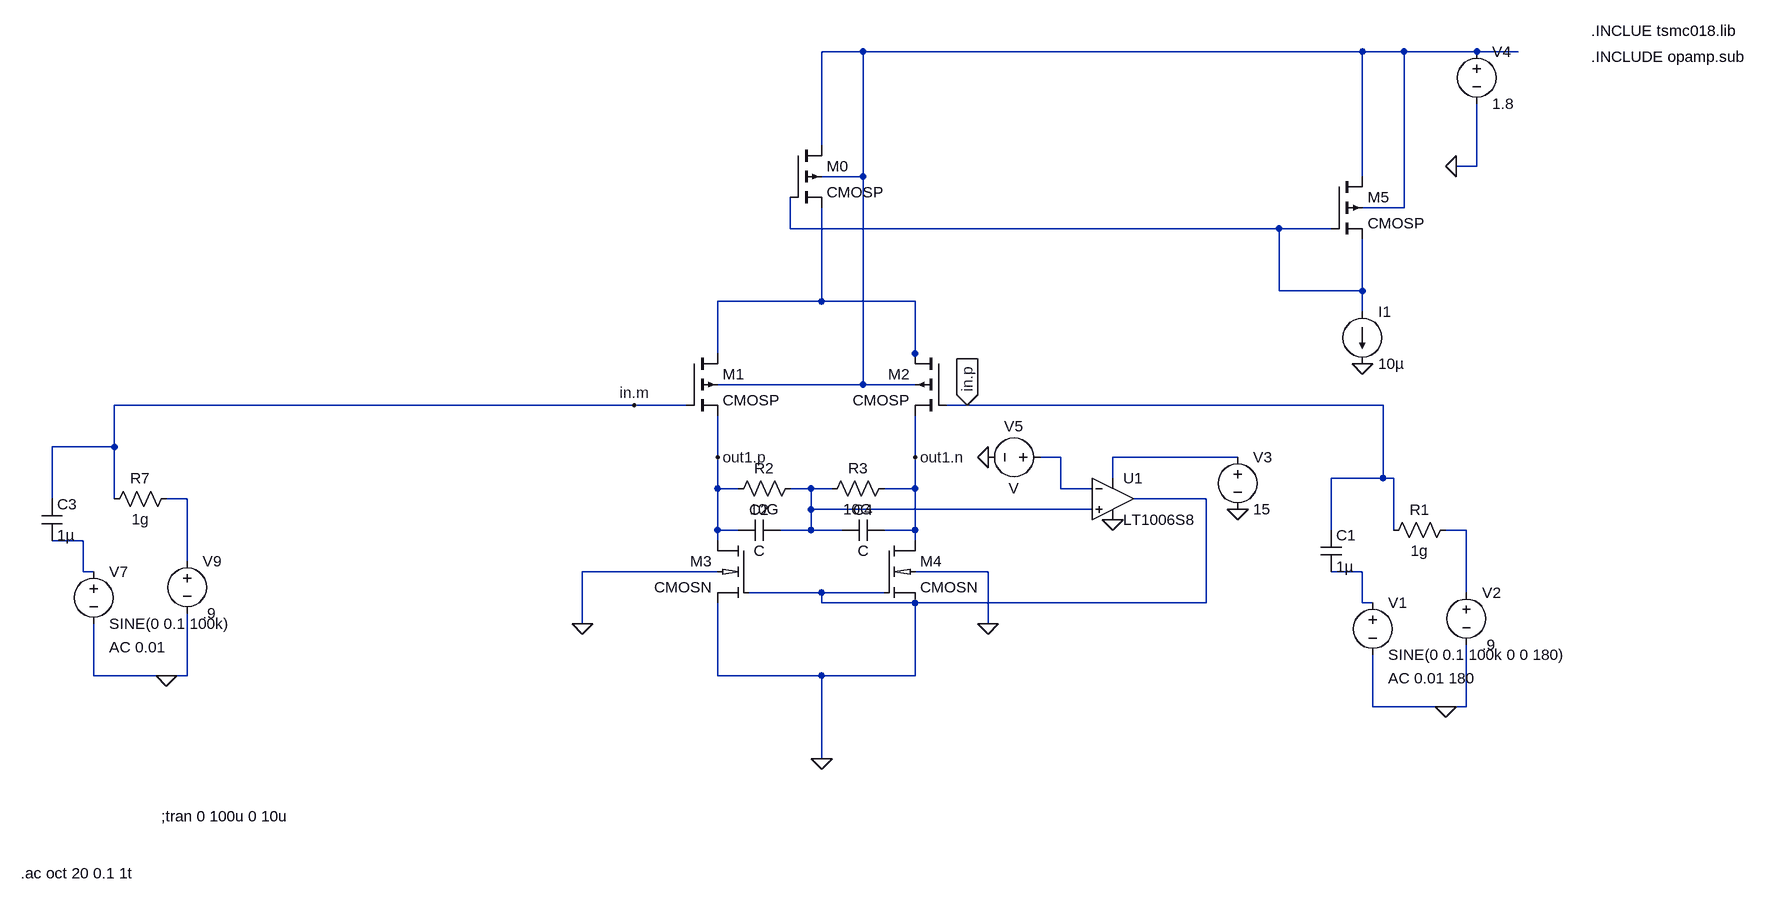
[diagram p0: schematic single_stage_diff.asc]
single_stage_diff.asc, the LTspice schematic file:
Version 4
SHEET 1 1436 736
WIRE 48 -544 -16 -544
WIRE 816 -544 48 -544
WIRE 880 -544 816 -544
WIRE 992 -544 880 -544
WIRE 1056 -544 992 -544
WIRE -16 -400 -16 -544
WIRE 992 -368 992 -464
WIRE 992 -368 960 -368
WIRE 48 -352 48 -544
WIRE 48 -352 -16 -352
WIRE 816 -352 816 -544
WIRE 880 -304 880 -544
WIRE 880 -304 816 -304
WIRE -64 -272 -64 -320
WIRE 688 -272 -64 -272
WIRE 768 -272 688 -272
WIRE 688 -176 688 -272
WIRE 816 -176 816 -256
WIRE 816 -176 688 -176
WIRE -16 -160 -16 -304
WIRE -16 -160 -176 -160
WIRE 128 -160 -16 -160
WIRE 816 -144 816 -176
WIRE -176 -80 -176 -160
WIRE 128 -80 128 -160
WIRE 128 -64 128 -80
WIRE 48 -32 48 -352
WIRE 48 -32 -176 -32
WIRE 128 -32 48 -32
WIRE -304 0 -1104 0
WIRE -224 0 -304 0
WIRE 208 0 176 0
WIRE 848 0 208 0
WIRE -1104 64 -1104 0
WIRE -1104 64 -1200 64
WIRE -176 80 -176 16
WIRE 128 80 128 16
WIRE 352 80 320 80
WIRE 624 80 432 80
WIRE 432 112 432 80
WIRE 848 112 848 0
WIRE 848 112 768 112
WIRE 864 112 848 112
WIRE -176 128 -176 80
WIRE -144 128 -176 128
WIRE -32 128 -64 128
WIRE 0 128 -32 128
WIRE 128 128 128 80
WIRE 128 128 80 128
WIRE 352 128 352 80
WIRE 400 128 352 128
WIRE -1200 144 -1200 64
WIRE -1104 144 -1104 64
WIRE -992 144 -1024 144
WIRE 576 144 464 144
WIRE -32 160 -32 128
WIRE 400 160 -32 160
WIRE -176 192 -176 128
WIRE -144 192 -176 192
WIRE -32 192 -32 160
WIRE -32 192 -80 192
WIRE 16 192 -32 192
WIRE 128 192 128 128
WIRE 128 192 80 192
WIRE 768 192 768 112
WIRE 864 192 864 112
WIRE 976 192 944 192
WIRE -1152 208 -1200 208
WIRE -176 208 -176 192
WIRE 128 208 128 192
WIRE -992 240 -992 144
WIRE -1152 256 -1152 208
WIRE -1136 256 -1152 256
WIRE -176 256 -384 256
WIRE 240 256 128 256
WIRE 816 256 768 256
WIRE -16 288 -128 288
WIRE 80 288 -16 288
WIRE 976 288 976 192
WIRE -16 304 -16 288
WIRE 128 304 -16 304
WIRE 576 304 576 144
WIRE 576 304 128 304
WIRE 816 304 816 256
WIRE 832 304 816 304
WIRE -384 336 -384 256
WIRE 240 336 240 256
WIRE -1136 416 -1136 336
WIRE -1024 416 -1136 416
WIRE -992 416 -992 320
WIRE -992 416 -1024 416
WIRE -176 416 -176 304
WIRE -16 416 -176 416
WIRE 128 416 128 304
WIRE 128 416 -16 416
WIRE 832 464 832 384
WIRE 944 464 832 464
WIRE 976 464 976 368
WIRE 976 464 944 464
WIRE -16 544 -16 416
FLAG -16 544 0
FLAG 208 0 in.p
IOPIN 208 0 In
FLAG -304 0 in.m
FLAG -176 80 out1.p
FLAG 128 80 out1.n
FLAG -1024 416 0
FLAG 816 -64 0
FLAG 944 464 0
FLAG 960 -368 0
FLAG -384 336 0
FLAG 240 336 0
FLAG 624 160 0
FLAG 432 176 0
FLAG 240 80 0
SYMBOL cmosn -128 208 M0
SYMATTR InstName M3
SYMATTR Value2 l=0.24u w=2u
SYMBOL cmosp -224 -80 R0
SYMATTR InstName M1
SYMATTR Value2 l=0.24u w=32u
SYMBOL cmosp -64 -400 R0
SYMATTR InstName M0
SYMATTR Value2 l=0.24u w=64u
SYMBOL cmosp 176 -80 M0
SYMATTR InstName M2
SYMATTR Value2 l=0.24u w=32u
SYMBOL cmosn 80 208 R0
SYMATTR InstName M4
SYMATTR Value2 l=0.24u w=2u
SYMBOL voltage -1136 240 R0
WINDOW 123 24 132 Left 0
WINDOW 39 0 0 Left 0
SYMATTR Value2 AC 0.01
SYMATTR InstName V7
SYMATTR Value SINE(0 0.1 100k)
SYMBOL voltage -992 224 R0
WINDOW 123 0 0 Left 0
WINDOW 39 0 0 Left 0
SYMATTR InstName V9
SYMATTR Value .9
SYMBOL res -1008 128 R90
WINDOW 0 0 56 VBottom 0
WINDOW 3 32 56 VTop 0
SYMATTR InstName R7
SYMATTR Value 1g
SYMBOL cap -1216 144 R0
SYMATTR InstName C3
SYMATTR Value 1µ
SYMBOL cmosp 768 -352 R0
SYMATTR InstName M5
SYMATTR Value2 l=0.24u w=6.4u
SYMBOL current 816 -144 R0
WINDOW 123 0 0 Left 0
WINDOW 39 0 0 Left 0
SYMATTR InstName I1
SYMATTR Value 10µ
SYMBOL voltage 832 288 R0
WINDOW 123 24 132 Left 0
WINDOW 39 0 0 Left 0
SYMATTR Value2 AC 0.01 180
SYMATTR InstName V1
SYMATTR Value SINE(0 0.1 100k 0 0 180)
SYMBOL voltage 976 272 R0
WINDOW 123 0 0 Left 0
WINDOW 39 0 0 Left 0
SYMATTR InstName V2
SYMATTR Value .9
SYMBOL res 960 176 R90
WINDOW 0 0 56 VBottom 0
WINDOW 3 32 56 VTop 0
SYMATTR InstName R1
SYMATTR Value 1g
SYMBOL cap 752 192 R0
SYMATTR InstName C1
SYMATTR Value 1µ
SYMBOL voltage 992 -560 R0
WINDOW 123 0 0 Left 0
WINDOW 39 0 0 Left 0
SYMATTR InstName V4
SYMATTR Value 1.8
SYMBOL res -48 112 R90
WINDOW 0 0 56 VBottom 0
WINDOW 3 32 56 VTop 0
SYMATTR InstName R2
SYMATTR Value 10G
SYMBOL res 96 112 R90
WINDOW 0 0 56 VBottom 0
WINDOW 3 32 56 VTop 0
SYMATTR InstName R3
SYMATTR Value 10G
SYMBOL Opamps\\LT1006S8 432 80 R0
SYMATTR InstName U1
SYMBOL cap -80 176 R90
WINDOW 0 0 32 VBottom 0
WINDOW 3 32 32 VTop 0
SYMATTR InstName C2
SYMBOL cap 80 176 R90
WINDOW 0 0 32 VBottom 0
WINDOW 3 32 32 VTop 0
SYMATTR InstName C4
SYMBOL voltage 624 64 R0
WINDOW 123 0 0 Left 0
WINDOW 39 0 0 Left 0
SYMATTR InstName V3
SYMATTR Value 15
SYMBOL voltage 336 80 R90
WINDOW 0 -32 56 VBottom 0
WINDOW 3 32 56 VTop 0
SYMATTR InstName V5
TEXT 1168 -576 Left 0 !.INCLUE tsmc018.lib
TEXT 1168 -536 Left 0 !.INCLUDE opamp.sub
TEXT -1248 720 Left 0 !.ac oct 20 0.1 1t
TEXT -1032 632 Left 0 !;tran 0 100u 0 10u

The netlist it stands for:
* single_stage_diff.asc
M3 out1.p 0 0 0 CMOSN l=0.24u w=2u
M1 N003 in.m out1.p N001 CMOSP l=0.24u w=32u
M0 N001 N002 N003 N001 CMOSP l=0.24u w=64u
M2 N003 in.p out1.n N001 CMOSP l=0.24u w=32u
M4 out1.n 0 0 0 CMOSN l=0.24u w=2u
V7 N009 0 SINE(0 0.1 100k) AC 0.01
V9 N007 0 .9
R7 N007 in.m 1g
C3 in.m N009 1µ
M5 N001 N002 N002 N001 CMOSP l=0.24u w=6.4u
I1 N002 0 10µ
V1 N010 0 SINE(0 0.1 100k 0 0 180) AC 0.01 180
V2 N008 0 .9
R1 N008 in.p 1g
C1 in.p N010 1µ
V4 N001 0 1.8
R2 N006 out1.p 10G
R3 out1.n N006 10G
XU1 N006 N004 N005 0 0 LT1006S8  ; pins In+ In- V+ V- OUT
C2 N006 out1.p C
C4 out1.n N006 C
V3 N005 0 15
V5 N004 0 V
.model NMOS NMOS
.model PMOS PMOS
.lib standard.mos
.INCLUE tsmc018.lib
.INCLUDE opamp.sub
.ac oct 20 0.1 1t
;tran 0 100u 0 10u
.lib tsmc018.lib
.backanno
.end